# EAGLE design BSPD_rev11 (EAGLE 9.6.2)
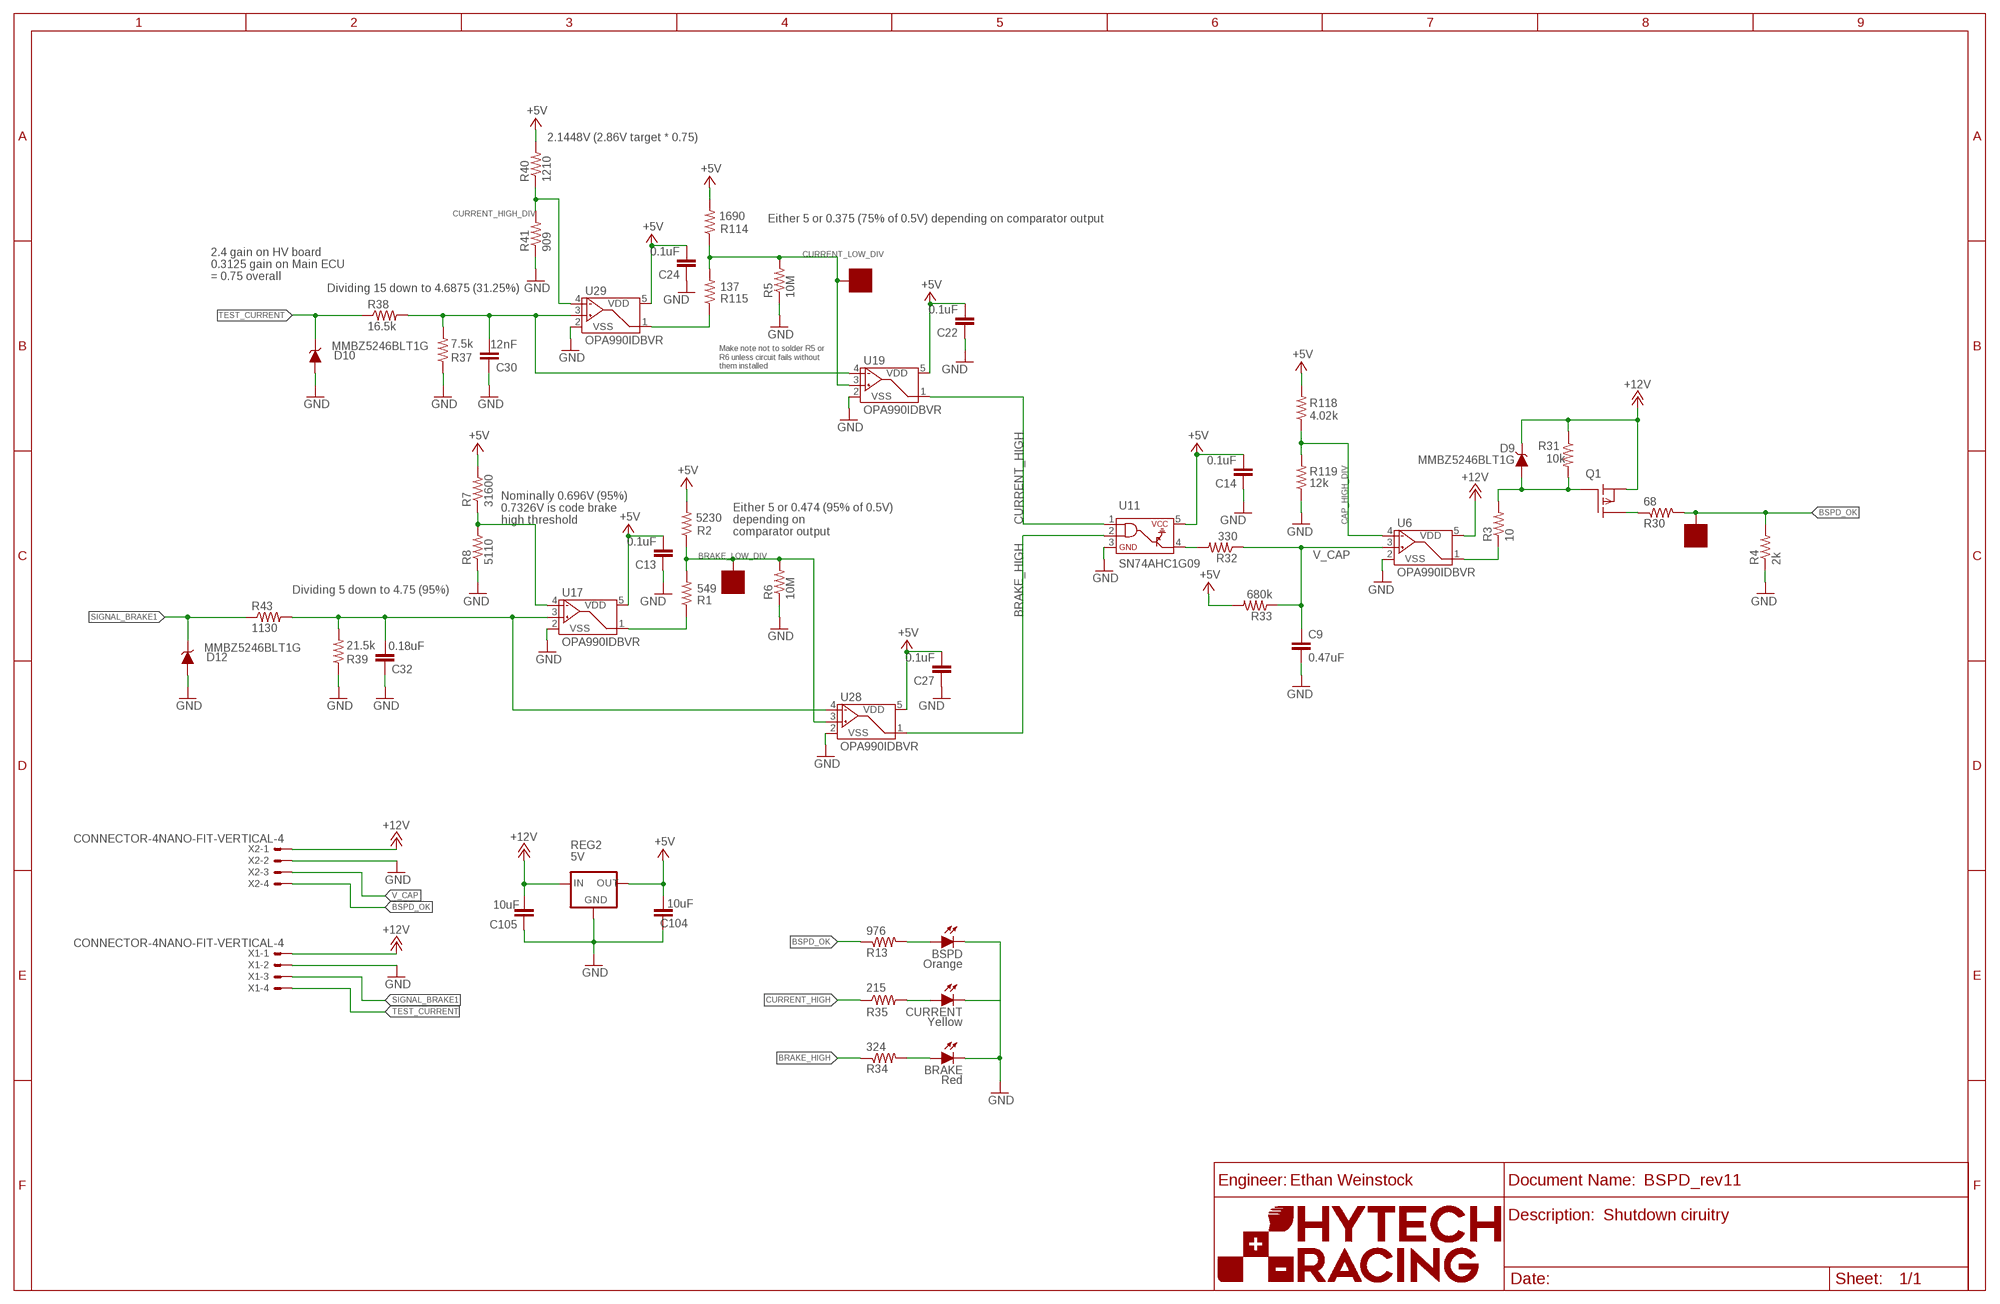
[diagram p0: schematic, sheet 1]
U202 (FRAME_B_L): ORIENTATION: LANDSCAPE; SIZE: B

## Parts
BRAKE  Red  LED-0805  [LED-805]
BRAKE_LOW_DIV  SOLDER_PAD  [SOLDER_PAD_XSMALL]
BSPD  Orange  LED-0805  [LED-805]
BSPD_OK  SOLDER_PAD  [SOLDER_PAD_XSMALL]
C9  0.47uF  CAP0603-CAP  [0603-CAP]
C13  0.1uF  CAP0603-CAP  [0603-CAP]
C14  0.1uF  CAP0603-CAP  [0603-CAP]
C22  0.1uF  CAP0603-CAP  [0603-CAP]
C24  0.1uF  CAP0603-CAP  [0603-CAP]
C27  0.1uF  CAP0603-CAP  [0603-CAP]
C30  12nF  CAP0603-CAP  [0603-CAP]
C32  0.18uF  CAP0603-CAP  [0603-CAP]
C104  10uF  CAP0603-CAP  [0603-CAP]
C105  10uF  CAP0603-CAP  [0603-CAP]
CURRENT  Yellow  LED-0805  [LED-805]
CURRENT_LOW_DIV  SOLDER_PAD  [SOLDER_PAD_XSMALL]
D9  MMBZ5246BLT1G  DIODE_ZENER  [SOT23]
D10  MMBZ5246BLT1G  DIODE_ZENER  [SOT23]
D12  MMBZ5246BLT1G  DIODE_ZENER  [SOT23]
Q1  P-CHANNEL_MOSFET_DMP3099L-7  [SOT23]
R1  549  RESISTOR0603  [0603-RES]
R2  5230  RESISTOR0603  [0603-RES]
R3  10  RESISTOR0603  [0603-RES]
R4  2k  RESISTOR0603  [0603-RES]
R5  10M  RESISTOR0603  [0603-RES]
R6  10M  RESISTOR0603  [0603-RES]
R7  31600  RESISTOR0603  [0603-RES]
R8  5110  RESISTOR0603  [0603-RES]
R13  976  RESISTOR0603  [0603-RES]
R30  68  RESISTOR0603  [0603-RES]
R31  10k  RESISTOR0603  [0603-RES]
R32  330  RESISTOR0603  [0603-RES]
R33  680k  RESISTOR0603  [0603-RES]
R34  324  RESISTOR0603  [0603-RES]
R35  215  RESISTOR0603  [0603-RES]
R37  7.5k  RESISTOR0603  [0603-RES]
R38  16.5k  RESISTOR0603  [0603-RES]
R39  21.5k  RESISTOR0603  [0603-RES]
R40  1210  RESISTOR0603  [0603-RES]
R41  909  RESISTOR0603  [0603-RES]
R43  1130  RESISTOR0603  [0603-RES]
R114  1690  RESISTOR0603  [0603-RES]
R115  137  RESISTOR0603  [0603-RES]
R118  4.02k  RESISTOR0603  [0603-RES]
R119  12k  RESISTOR0603  [0603-RES]
REG2  5V  OKI-78SR-5  [OKI-78SR]
U6  OPA990IDBVR  [SOT-23-5]
U11  SN74AHC1G09  [SOT-23-5]
U17  OPA990IDBVR  [SOT-23-5]
U19  OPA990IDBVR  [SOT-23-5]
U28  OPA990IDBVR  [SOT-23-5]
U29  OPA990IDBVR  [SOT-23-5]
X1  CONNECTOR-4NANO-FIT-VERTICAL-4  [NANO-FIT_VERTICAL-4]
X2  CONNECTOR-4NANO-FIT-VERTICAL-4  [NANO-FIT_VERTICAL-4]

## Nets
+5V: C13.2 C14.2 C22.2 C24.2 C27.2 C104.2 R2.2 R7.2 R33.2 R40.2 R114.2 R118.2 REG2.3(OUT) U11.5 U17.5(VDD) U19.5(VDD) U28.5(VDD) U29.5(VDD)
+12V: C105.2 D9.3(C) Q1.2(S) R31.1 REG2.1(IN) U6.5(VDD) X1.P$1 X2.P$1
BRAKE_HIGH: R34.1 U11.2 U28.1(VOUT)
BRAKE_LOW_DIV: BRAKE_LOW_DIV.P$1 R1.2 R2.1 R6.2 U28.3(VIN+)
BSPD_OK: BSPD_OK.P$1 R4.2 R13.1 R30.2 X2.P$4
CAP_HIGH_DIV: R118.1 R119.2 U6.4(VIN-)
CURRENT_HIGH: R35.1 U11.1 U19.1(VOUT)
CURRENT_HIGH_DIV: R40.1 R41.2 U29.4(VIN-)
CURRENT_LOW_DIV: CURRENT_LOW_DIV.P$1 R5.2 R114.1 R115.2 U19.3(VIN+)
GND: BRAKE.C BSPD.C C9.2 C13.1 C14.1 C22.1 C24.1 C27.1 C30.1 C32.1 C104.1 C105.1 CURRENT.C D10.1(A) D12.1(A) R4.1 R5.1 R6.1 R8.1 R37.1 R39.1 R41.1 R119.1 REG2.2(GND) U6.2(VSS) U11.3 U17.2(VSS) U19.2(VSS) U28.2(VSS) U29.2(VSS) X1.P$2 X2.P$2
N$1: Q1.3(D) R30.1
N$3: R1.1 U17.1(VOUT)
N$4: R3.1 U6.1(VOUT)
N$5: C32.2 R39.2 R43.2 U17.3(VIN+) U28.4(VIN-)
N$15: R7.1 R8.2 U17.4(VIN-)
N$19: R115.1 U29.1(VOUT)
N$102: CURRENT.A R35.2
N$103: BRAKE.A R34.2
N$106: C30.2 R37.2 R38.2 U19.4(VIN-) U29.3(VIN+)
N$107: R32.2 U11.4
N$108: BSPD.A R13.2
N$112: D9.1(A) Q1.1(G) R3.2 R31.2
SIGNAL_BRAKE1: D12.3(C) R43.1 X1.P$3
TEST_CURRENT: D10.3(C) R38.1 X1.P$4
V_CAP: C9.1 R32.1 R33.1 U6.3(VIN+) X2.P$3

## Notes on the sheet
- 2.1448V (2.86V target * 0.75)
- Either 5 or 0.375 (75% of 0.5V) depending on comparator output
- 2.4 gain on HV board
  0.3125 gain on Main ECU
  = 0.75 overall
- Dividing 15 down to 4.6875 (31.25%)
- Make note not to solder R5 or 
  R6 unless circuit fails without
  them installed
- Nominally 0.696V (95%)
  0.7326V is code brake
  high threshold
- Either 5 or 0.474 (95% of 0.5V)
  depending on
  comparator output
- Dividing 5 down to 4.75 (95%)
- Ethan Weinstock
- Shutdown ciruitry

## Library data of the parts
BRAKE BSPD CURRENT = HyTechDevices:LED: Light Emitting Diode (LED) Source: Dangerous Prototypes Eagle Library <https://github.com/DangerousPrototypes/Eagle_Part_Library>
BRAKE_LOW_DIV BSPD_OK CURRENT_LOW_DIV = HyTechDevices:SOLDER_PAD: Solder pad used to attach wires directly to PCB
C9 C13 C14 C22 C24 C27 C30 C32 C104 C105 = HyTechDevices:CAP: Capacitor Standard 0603 ceramic capacitor, and 0.1" leaded capacitor.
D9 D10 D12 = HyTechDevices:DIODE_ZENER: ZENER DIODE
Q1 = HyTechDevices:P-CHANNEL_MOSFET_DMP3099L-7: Diodes Incorporated P-Channel Enhancement Mode MOSFET Datasheet <http://www.mouser.com/ds/2/115/DMP3099L-266220.pdf>
R1-R8 R13 R30-R35 R37-R41 R43 R114 R115 R118 R119 = HyTechDevices:RESISTOR: Resistor Basic schematic elements and footprints for 0603, 1206, and PTH resistors.
REG2 = HyTechDevices:OKI-78SR-5: Murata OKI-78SR 5V 1.5A Non-Isolated Switching Regulator DC/DC - Datasheet <https://power.murata.com/data/power/oki-78sr.pdf>
U6 U17 U19 U28 U29 = HyTechDevices:OPA990IDBVR: TI OPA990 20V Op-Amp Comparator Datasheet <https://www.ti.com/lit/ds/symlink/opa990.pdf>
U11 = HyTechDevices:SN74AHC1G09: TI SN74AHC1G09 Single 2–Input Positive-AND Gate With Open-Drain Output Datasheet <http://www.ti.com/lit/ds/symlink/sn74ahc1g09.pdf>
X1 X2 = HyTechDevices:CONNECTOR-4: Mini-Fit Junior connector 4 pole Source: http://www.molex.com

## Board
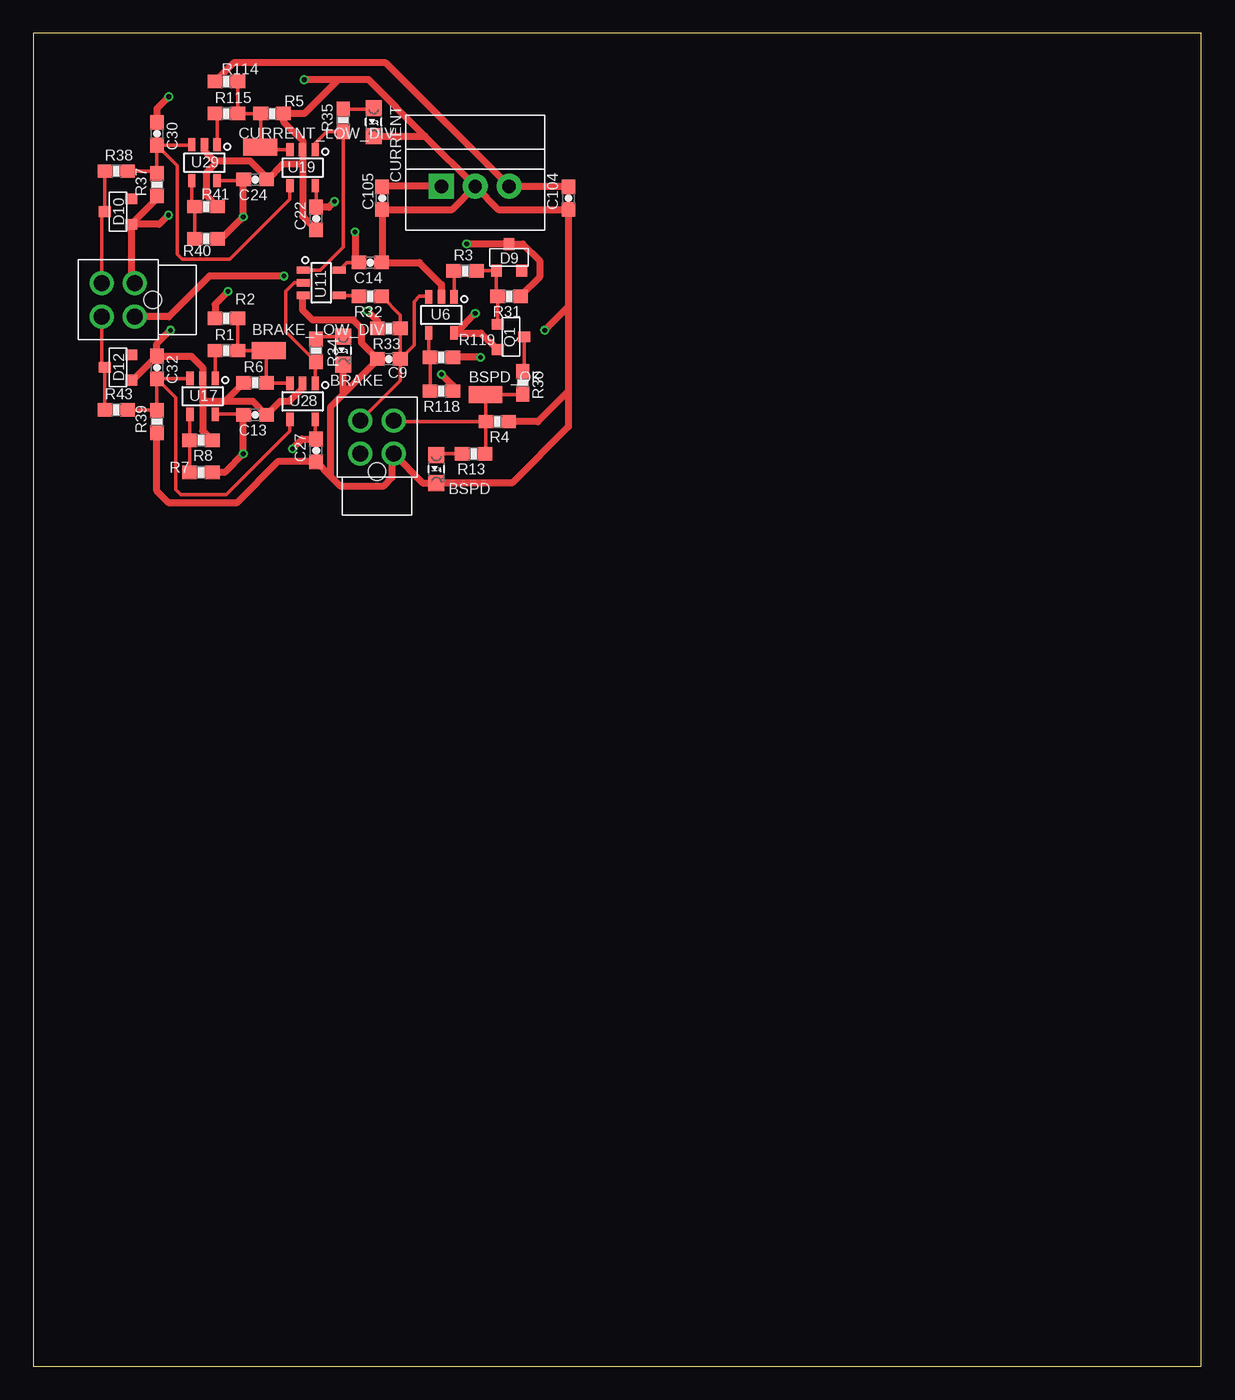
[diagram p1: board, top side]
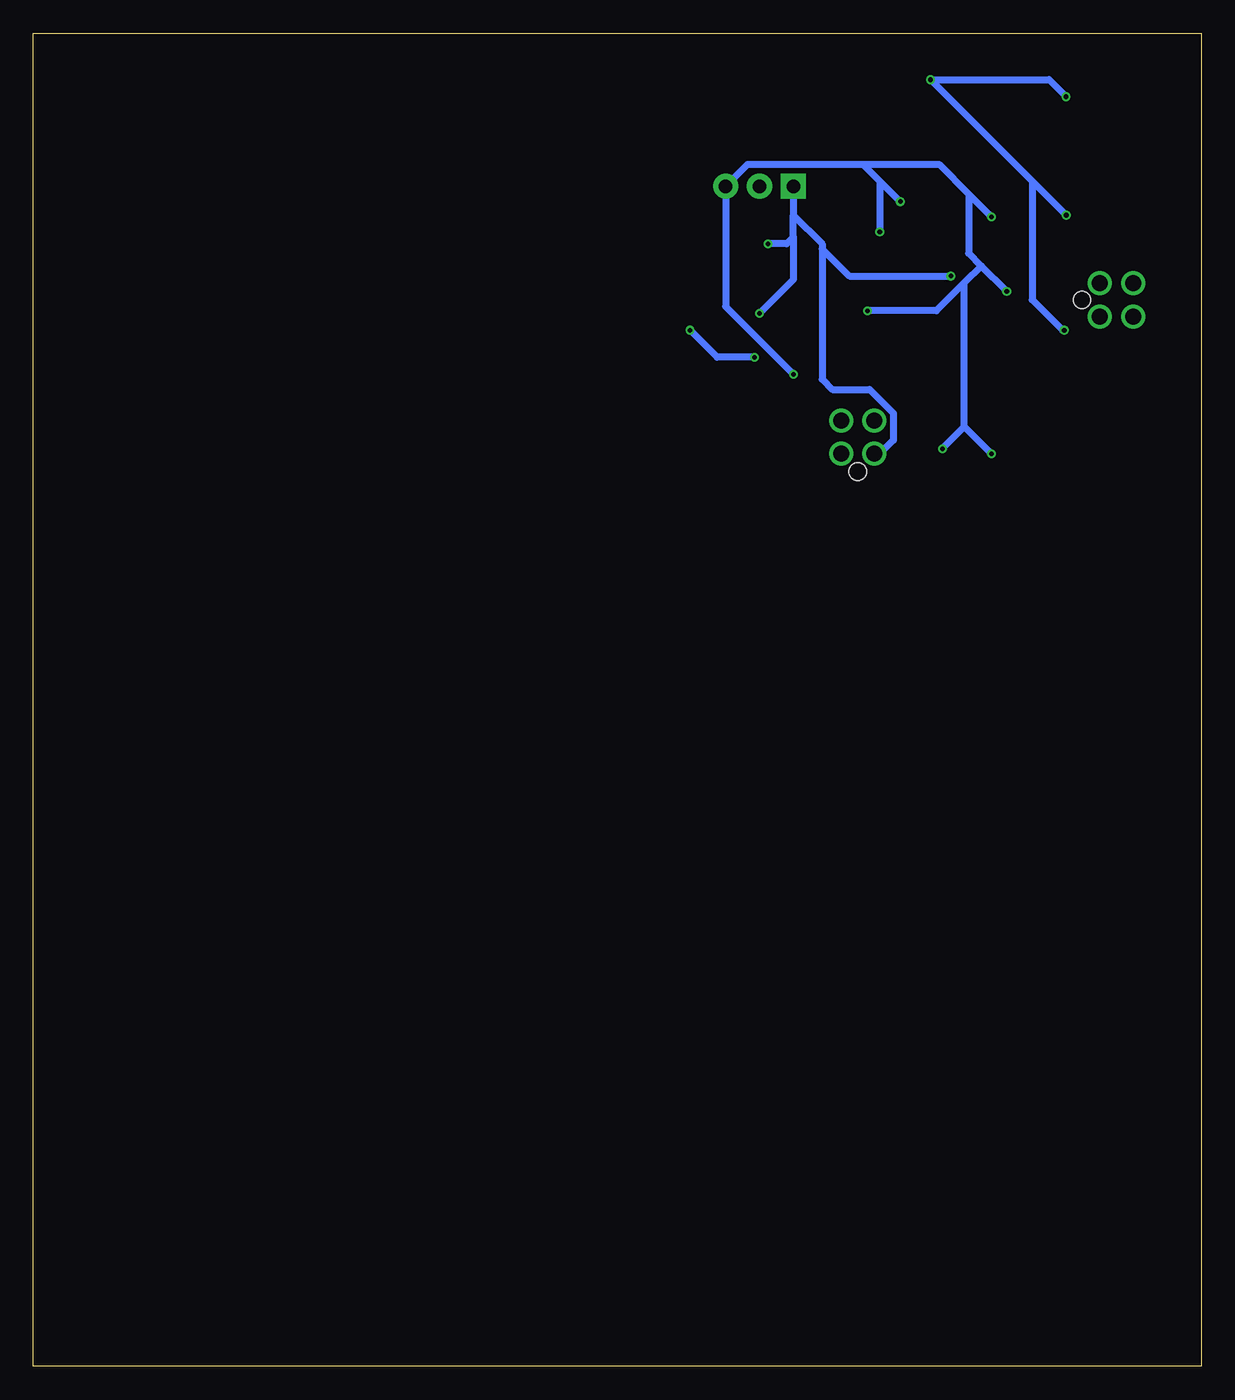
[diagram p2: board, bottom side, seen from below]

Size 87.61 x 100 mm. Coordinates in mm from the lower left corner, seen from the top.
Outline: 0,0 87.61,0 87.61,100 0,100 0,0
Copper layers (1*16): Top 0.035mm / dielectric 1.53mm / Bottom 0.035mm
Design rules "JLCPCB (2 Layer)": minimum track width 5mil, minimum drill 0.3mm, track to track 5mil, track to pad 5mil, pad to pad 5mil, via to via 20mil, smd to smd 5mil, copper to edge 0.2mm, drill to drill 21mil, minimum pad ring 6mil, minimum via ring 6mil, stop-mask expansion 6mil, vias tented up to drill 30mil, thermal gap 10mil

### Footprints (pad centres in the part's own frame; a part is rotated, then mirrored left to right if it is on the bottom)
LED-805 = smd 1.2 x 1.2: A 0,-1.05; C 0,1.05
SOLDER_PAD_XSMALL = smd 2.54 x 1.27: P$1 0,0
0603-CAP = smd 1.1 x 1: 1 -0.85,0; 2 0.85,0
SOT23 = smd 0.8 x 0.9: 1 -0.95,-1; 2 0.95,-1; 3 0,1
0603-RES = smd 1.1 x 1: 1 -0.85,0; 2 0.85,0
OKI-78SR = drill 1 pad 1.88 square: 1 -2.54,0 | drill 1 pad 1.88: 2 0,0; 3 2.54,0
SOT-23-5 = smd 1 x 0.55: 1 -1.35,0.95; 2 -1.35,0; 3 -1.35,-0.95; 4 1.35,-0.95; 5 1.35,0.95
NANO-FIT_VERTICAL-4 = drill 1.2: P$1 -1.25,0; P$2 1.25,0; P$3 -1.25,2.5; P$4 1.25,2.5 | hole 1.3: 0,-1.34

### Placement (x,y rotation side)
BRAKE  23.24,76.2 180 top
BRAKE_LOW_DIV  17.65,76.2 0 top
BSPD  30.23,67.31 180 top
BSPD_OK  33.91,72.9 0 top
C9  26.67,75.56 180 top
C13  16.64,71.37 180 top
C14  25.27,82.8 180 top
C22  21.21,86.11 90 top
C24  16.64,89.03 180 top
C27  21.21,68.71 90 top
C30  9.27,92.46 270 top
C32  9.27,74.93 270 top
C104  40.13,87.63 90 top
C105  26.16,87.63 90 top
CURRENT  25.53,93.34 180 top
CURRENT_LOW_DIV  17.02,91.44 0 top
D9  35.69,83.19 0 top
D10  6.35,86.61 90 top
D12  6.35,74.93 90 top
Q1  35.81,77.22 270 top
R1  14.48,76.2 0 top
R2  14.48,78.61 180 top
R3  32.38,82.17 0 top
R4  34.8,70.87 180 top
R5  17.91,93.98 180 top
R6  16.64,73.79 0 top
R7  12.57,67.06 0 top
R8  12.57,69.47 180 top
R13  33.02,68.45 180 top
R30  36.7,73.79 270 top
R31  35.69,80.26 180 top
R32  25.27,80.26 180 top
R33  26.67,77.85 180 top
R34  21.21,76.2 90 top
R35  23.24,93.47 90 top
R37  9.27,88.65 90 top
R38  6.22,89.66 0 top
R39  9.27,70.87 90 top
R40  12.95,84.58 0 top
R41  12.95,87 180 top
R43  6.22,71.75 0 top
R114  14.48,96.39 180 top
R115  14.48,93.98 0 top
R118  30.61,73.15 0 top
R119  30.61,75.69 180 top
REG2  33.15,88.52 0 top
U6  30.61,78.87 270 top
U11  21.59,81.28 0 top
U17  12.7,72.77 270 top
U19  20.19,89.92 270 top
U28  20.19,72.39 270 top
U29  12.83,90.3 270 top
X1  7.62,80.01 90 top
X2  25.78,68.45 0 top

### Tracks (layer width: path | path; a pad name or v marks a point on that pad's centre or on a via)
+5V  (via drill 0.35)
  Top 0.254: U11.5 23.51,82.8 C14.2 | U28.5 21.14,69.62 C27.2 | U17.5 15.74,71.42 C13.2 | U19.5 21.21,88.5 C22.2 | U29.5 15.71,88.95 C24.2
  Top 0.508: C104.2 40.09,88.52 REG2.3 26.42,97.79 15.03,97.79 R114.2 | v22.58,87.38 22.16,86.96 C22.2 | v24.13,85.09 24.13,83.1 C14.2 | R40.2 14.1,84.58 v15.75,86.23 15.75,88.99 C24.2 | v14.61,80.64 13.63,79.67 R2.2 | R33.2 25.82,78.41 v25.05,79.18 | R7.2 14.35,67.06 v15.75,68.45 15.75,71.33 C13.2 | v19.43,68.83 20.15,69.56 C27.2 | v30.61,74.42 31.46,73.57 R118.2
  Bottom 0.508: 25.4,90.17 34.04,90.17 REG2.3 35.69,79.5 v30.61,74.42 | 25.4,90.17 19.68,90.17 17.46,87.95 | 17.46,87.95 v15.75,86.23 | 25.4,90.17 24.13,88.9 | 24.13,88.9 22.61,87.38 v22.58,87.38 | 24.13,88.9 v24.13,85.09 | 17.46,87.95 17.46,83.5 16.51,82.55 | v14.61,80.64 16.51,82.55 | v25.05,79.18 19.88,79.18 17.78,81.28 | 16.51,82.55 17.78,81.28 | 17.78,70.48 17.78,81.28 | 17.78,70.48 v15.75,68.45 | 17.78,70.48 v19.43,68.83
+12V  (via drill 0.35)
  Top 0.508: REG2.1 26.2,88.52 C105.2 | v32.51,84.2 35.67,84.2 D9.3 36.72,84.19 37.97,82.93 37.97,81.7 R31.1 | v33.15,78.99 31.67,77.52 U6.5 33.56,77.52 Q1.2 | v18.8,81.79 13.21,81.79 10.16,78.74 7.64,78.74 X1.P$1
  Bottom 0.508: REG2.1 30.61,86.36 | 30.61,84.71 30.61,86.36 | 30.61,84.71 31.11,84.2 v32.51,84.2 | 30.61,84.71 30.61,81.53 v33.15,78.99 | 30.61,86.36 28.45,84.2 28.45,83.82 | 28.45,83.82 28.45,74.04 27.69,73.28 24.89,73.28 23.11,71.5 23.11,69.47 24.13,68.45 X2.P$1 | 28.45,83.82 26.42,81.79 v18.8,81.79
BRAKE_HIGH
  Top 0.152: 21.19,75.33 R34.1
  Top 0.254: R34.1 18.92,77.64 18.92,80.64 19.56,81.28 U11.2 | U28.1 21.14,75.28 21.19,75.33
BRAKE_LOW_DIV
  Top 0.152: 17.57,73.87 R6.2
  Top 0.254: U28.3 17.7,73.74 17.57,73.87 | R6.2 17.49,76.03 BRAKE_LOW_DIV.P$1 R1.2 R2.1
BSPD_OK
  Top 0.152: 33.95,68.53 R13.1
  Top 0.254: R30.2 36.66,72.9 BSPD_OK.P$1 33.95,72.86 R4.2 | R4.2 33.95,68.53 | R4.2 27.12,70.87 X2.P$4
CAP_HIGH_DIV
  Top 0.254: U6.4 29.66,75.79 R119.2 R118.1
CURRENT_HIGH
  Top 0.254: U11.1 21.52,82.23 23.24,83.95 R35.1 22.01,92.62 21.14,91.75 U19.1
CURRENT_HIGH_DIV
  Top 0.152: 11.88,87.22 R41.2
  Top 0.254: U29.4 11.88,87.22 | R41.2 R40.1
CURRENT_LOW_DIV
  Top 0.152: 15.37,94.02 R115.2
  Top 0.254: U19.3 17.19,91.27 CURRENT_LOW_DIV.P$1 17.06,91.48 R5.2 R115.2 | R114.1 15.33,94.06 15.37,94.02
GND  (via drill 0.35)
  Top 0.508: REG2.2 31.41,86.78 C105.1 26.16,82.84 C14.1 28.96,82.8 30.61,81.15 U6.2 | REG2.2 34.89,86.78 C104.1 40.13,79.5 | C22.1 20.19,86.27 20.19,90.17 | 13.59,90.42 12.83,91.19 U29.2 | v10.16,95.25 9.27,94.36 C30.1 | v10.14,86.36 9.44,85.66 D10.1 | R4.1 37.85,70.87 40.13,73.15 | v33.53,75.69 R119.1 | v10.29,77.72 9.27,76.71 C32.1 | C32.1 7.47,73.98 D12.1 | C32.1 11.85,75.78 12.7,74.93 U17.2 12.7,72.39 | 13.59,90.42 16.26,90.42 17.49,89.19 C24.1 17.53,88.99 18.71,90.17 20.19,90.17 | D10.1 7.35,81.53 X1.P$2 | D10.1 9.27,87.58 R37.1 | U11.3 20.19,80.28 20.19,79.25 20.95,78.49 24,78.49 24.6,77.88 24.6,76.78 C9.2 25.82,75.52 23.24,72.94 | 20.19,90.17 U19.2 20.19,91.95 18.76,93.38 R5.1 20.32,93.98 22.86,96.52 | 13.59,90.42 13.59,90.17 12.95,89.53 12.95,87.84 R41.1 | 22.31,66.76 23.06,66.01 26.24,66.01 26.89,66.66 26.89,68.31 X2.P$2 29.22,66.26 BSPD.C 35.91,66.26 40.13,70.48 40.13,73.15 | 22.31,66.76 C27.1 18.33,67.86 15.24,64.77 10.16,64.77 9.27,65.66 R39.1 | R8.1 12.7,70.19 12.7,72.39 | 12.7,72.39 14.39,72.39 | 14.39,72.39 R6.1 | 14.39,72.39 16.47,72.39 C13.1 18.5,72.39 19.21,72.39 20.19,73.38 U28.2 | 40.13,79.5 v38.35,77.72 | 40.13,79.5 40.13,73.15 | REG2.2 29.37,92.3 | 29.37,92.3 25.15,96.52 22.86,96.52 | 22.86,96.52 v20.32,96.52 | CURRENT.C 29.37,92.3 | 22.31,66.76 22.31,72.01 23.24,72.94 | 23.24,72.94 BRAKE.C
  Bottom 0.508: v10.16,95.25 11.43,96.52 v20.32,96.52 12.7,88.9 | 12.7,88.9 10.16,86.36 v10.14,86.36 | v38.35,77.72 36.32,75.69 v33.53,75.69 | 12.7,88.9 12.7,80.01 10.41,77.72 v10.29,77.72
N$1
  Top 0.254: Q1.3 36.81,74.75 R30.1
N$3
  Top 0.152: 13.65,76.18 R1.1
  Top 0.254: U17.1 13.65,76.18
N$4
  Top 0.254: R3.1 31.56,82.15 U6.1
N$5
  Top 0.254: U17.3 11.71,74.08 C32.2 | C32.2 R39.2 7.11,71.72 R43.2 | C32.2 10.67,72.68 10.67,65.79 11.05,65.41 14.48,65.41 19.24,70.17 U28.4
N$15
  Top 0.254: U17.4 11.72,71.39 R8.2 R7.1
N$19
  Top 0.254: R115.1 13.78,93.83 U29.1
N$102
  Top 0.254: R35.2 25.45,94.32 CURRENT.A
N$103
  Top 0.254: R34.2 21.41,77.25 BRAKE.A
N$106
  Top 0.254: U29.3 11.84,91.61 C30.2 | C30.2 10.79,90.08 10.79,83.44 11.18,83.06 14.73,83.06 19.24,87.57 U19.4 | C30.2 R37.2 9.11,89.66 R38.2
N$107
  Top 0.254: U11.4 24.36,80.33 R32.2
N$108
  Top 0.254: R13.2 30.32,68.45 BSPD.A
N$112
  Top 0.152: 33.25,82.19 R3.2
  Top 0.254: 33.25,82.19 D9.1 34.74,80.36 R31.2 34.84,78.19 Q1.1
SIGNAL_BRAKE1
  Top 0.254: R43.1 5.35,71.78 D12.3 5.12,75.16 X1.P$3
TEST_CURRENT
  Top 0.152: 5.12,86.38 D10.3
  Top 0.254: R38.1 5.37,86.64 D10.3 | X1.P$4 5.12,86.38
V_CAP
  Top 0.152: 29.61,80.26 U6.3
  Top 0.254: R32.1 27.52,78.87 R33.1 C9.1 | C9.1 27.52,73.94 X2.P$3 | C9.1 28.57,76.62 28.57,79.88 28.96,80.26 29.61,80.26